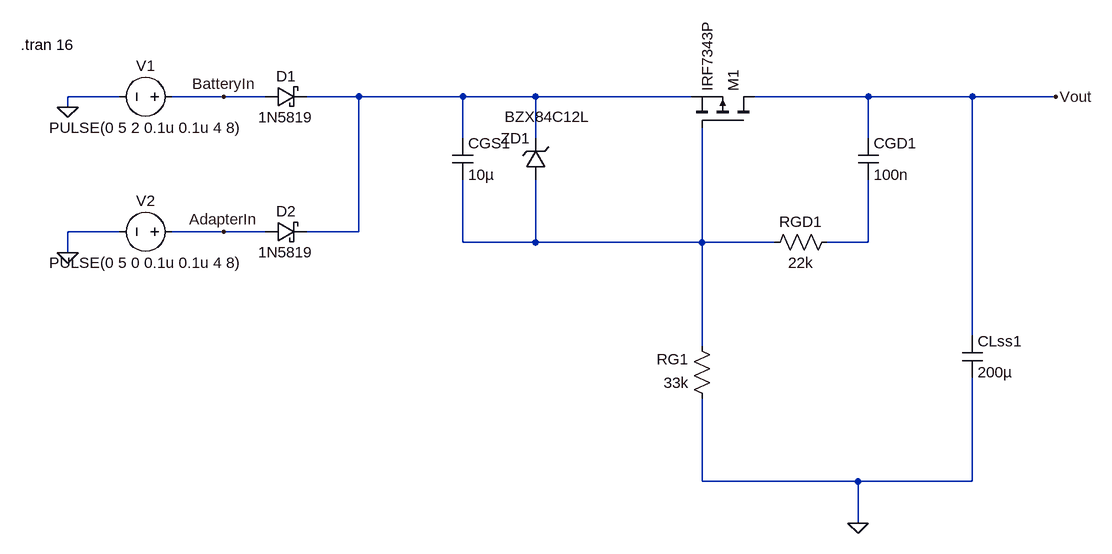
[diagram p0: schematic InputOrWithSoftStart.asc]
InputOrWithSoftStart.asc, the LTspice schematic file:
Version 4
SHEET 1 1984 1272
WIRE -64 128 -144 128
WIRE 96 128 16 128
WIRE 160 128 96 128
WIRE 304 128 224 128
WIRE 464 128 304 128
WIRE 576 128 464 128
WIRE 816 128 576 128
WIRE 1088 128 912 128
WIRE 1248 128 1088 128
WIRE 1376 128 1248 128
WIRE -144 144 -144 128
WIRE 464 192 464 128
WIRE 576 192 576 128
WIRE 1088 192 1088 128
WIRE -64 336 -144 336
WIRE 96 336 16 336
WIRE 160 336 96 336
WIRE 304 336 304 128
WIRE 304 336 224 336
WIRE 464 352 464 256
WIRE 576 352 576 256
WIRE 576 352 464 352
WIRE 832 352 832 176
WIRE 832 352 576 352
WIRE 944 352 832 352
WIRE 1088 352 1088 256
WIRE 1088 352 1024 352
WIRE -144 368 -144 336
WIRE 1248 496 1248 128
WIRE 832 512 832 352
WIRE 832 720 832 592
WIRE 1072 720 832 720
WIRE 1248 720 1248 560
WIRE 1248 720 1072 720
WIRE 1072 784 1072 720
FLAG -144 368 0
FLAG -144 144 0
FLAG 1072 784 0
FLAG 96 128 BatteryIn
FLAG 96 336 AdapterIn
FLAG 1376 128 Vout
SYMBOL Voltage 32 128 R90
WINDOW 0 -32 56 VBottom 2
WINDOW 3 32 56 VTop 2
SYMATTR InstName V1
SYMATTR Value PULSE(0 5 2 0.1u 0.1u 4 8)
SYMBOL Voltage 32 336 R90
WINDOW 0 -32 56 VBottom 2
WINDOW 3 32 56 VTop 2
SYMATTR InstName V2
SYMATTR Value PULSE(0 5 0 0.1u 0.1u 4 8)
SYMBOL schottky 160 144 R270
WINDOW 0 32 32 VTop 2
WINDOW 3 0 32 VBottom 2
SYMATTR InstName D1
SYMATTR Value 1N5819
SYMBOL schottky 160 352 R270
WINDOW 0 32 32 VTop 2
WINDOW 3 0 32 VBottom 2
SYMATTR InstName D2
SYMATTR Value 1N5819
SYMBOL Cap 448 192 R0
SYMATTR InstName CGS1
SYMATTR Value 10µ
SYMBOL zener 592 256 R180
WINDOW 0 24 64 Left 2
WINDOW 3 -68 97 Left 2
SYMATTR InstName ZD1
SYMATTR Value BZX84C12L
SYMBOL Res 1040 336 R90
WINDOW 0 0 56 VBottom 2
WINDOW 3 32 56 VTop 2
SYMATTR InstName RGD1
SYMATTR Value 22k
SYMBOL Res 848 608 R180
WINDOW 0 36 76 Left 2
WINDOW 3 36 40 Left 2
SYMATTR InstName RG1
SYMATTR Value 33k
SYMBOL Cap 1072 192 R0
SYMATTR InstName CGD1
SYMATTR Value 100n
SYMBOL Cap 1232 496 R0
SYMATTR InstName CLss1
SYMATTR Value 200µ
SYMBOL pmos 912 176 M270
SYMATTR InstName M1
SYMATTR Value IRF7343P
TEXT -216 48 Left 2 !.tran 16

The netlist it stands for:
* InputOrWithSoftStart.asc
V1 BatteryIn 0 PULSE(0 5 2 0.1u 0.1u 4 8)
V2 AdapterIn 0 PULSE(0 5 0 0.1u 0.1u 4 8)
D1 BatteryIn N001 1N5819
D2 AdapterIn N001 1N5819
CGS1 N001 N002 10µ
D§ZD1 N002 N001 BZX84C12L
RGD1 N003 N002 22k
RG1 0 N002 33k
CGD1 Vout N003 100n
CLss1 Vout 0 200µ
M1 Vout N002 N001 N001 IRF7343P
.model D D
.lib standard.dio
.model NMOS NMOS
.model PMOS PMOS
.lib standard.mos
.tran 16
.backanno
.end